# EasyEDA schematic 2513_Replacement.json
TITLE: APPLE-1 2513 CHAR ROM REPLACEMENT; REV: 1.2; Date: 2021-05-20; Sheet: 1/1; Drawn By: CP; Company: P-LAB
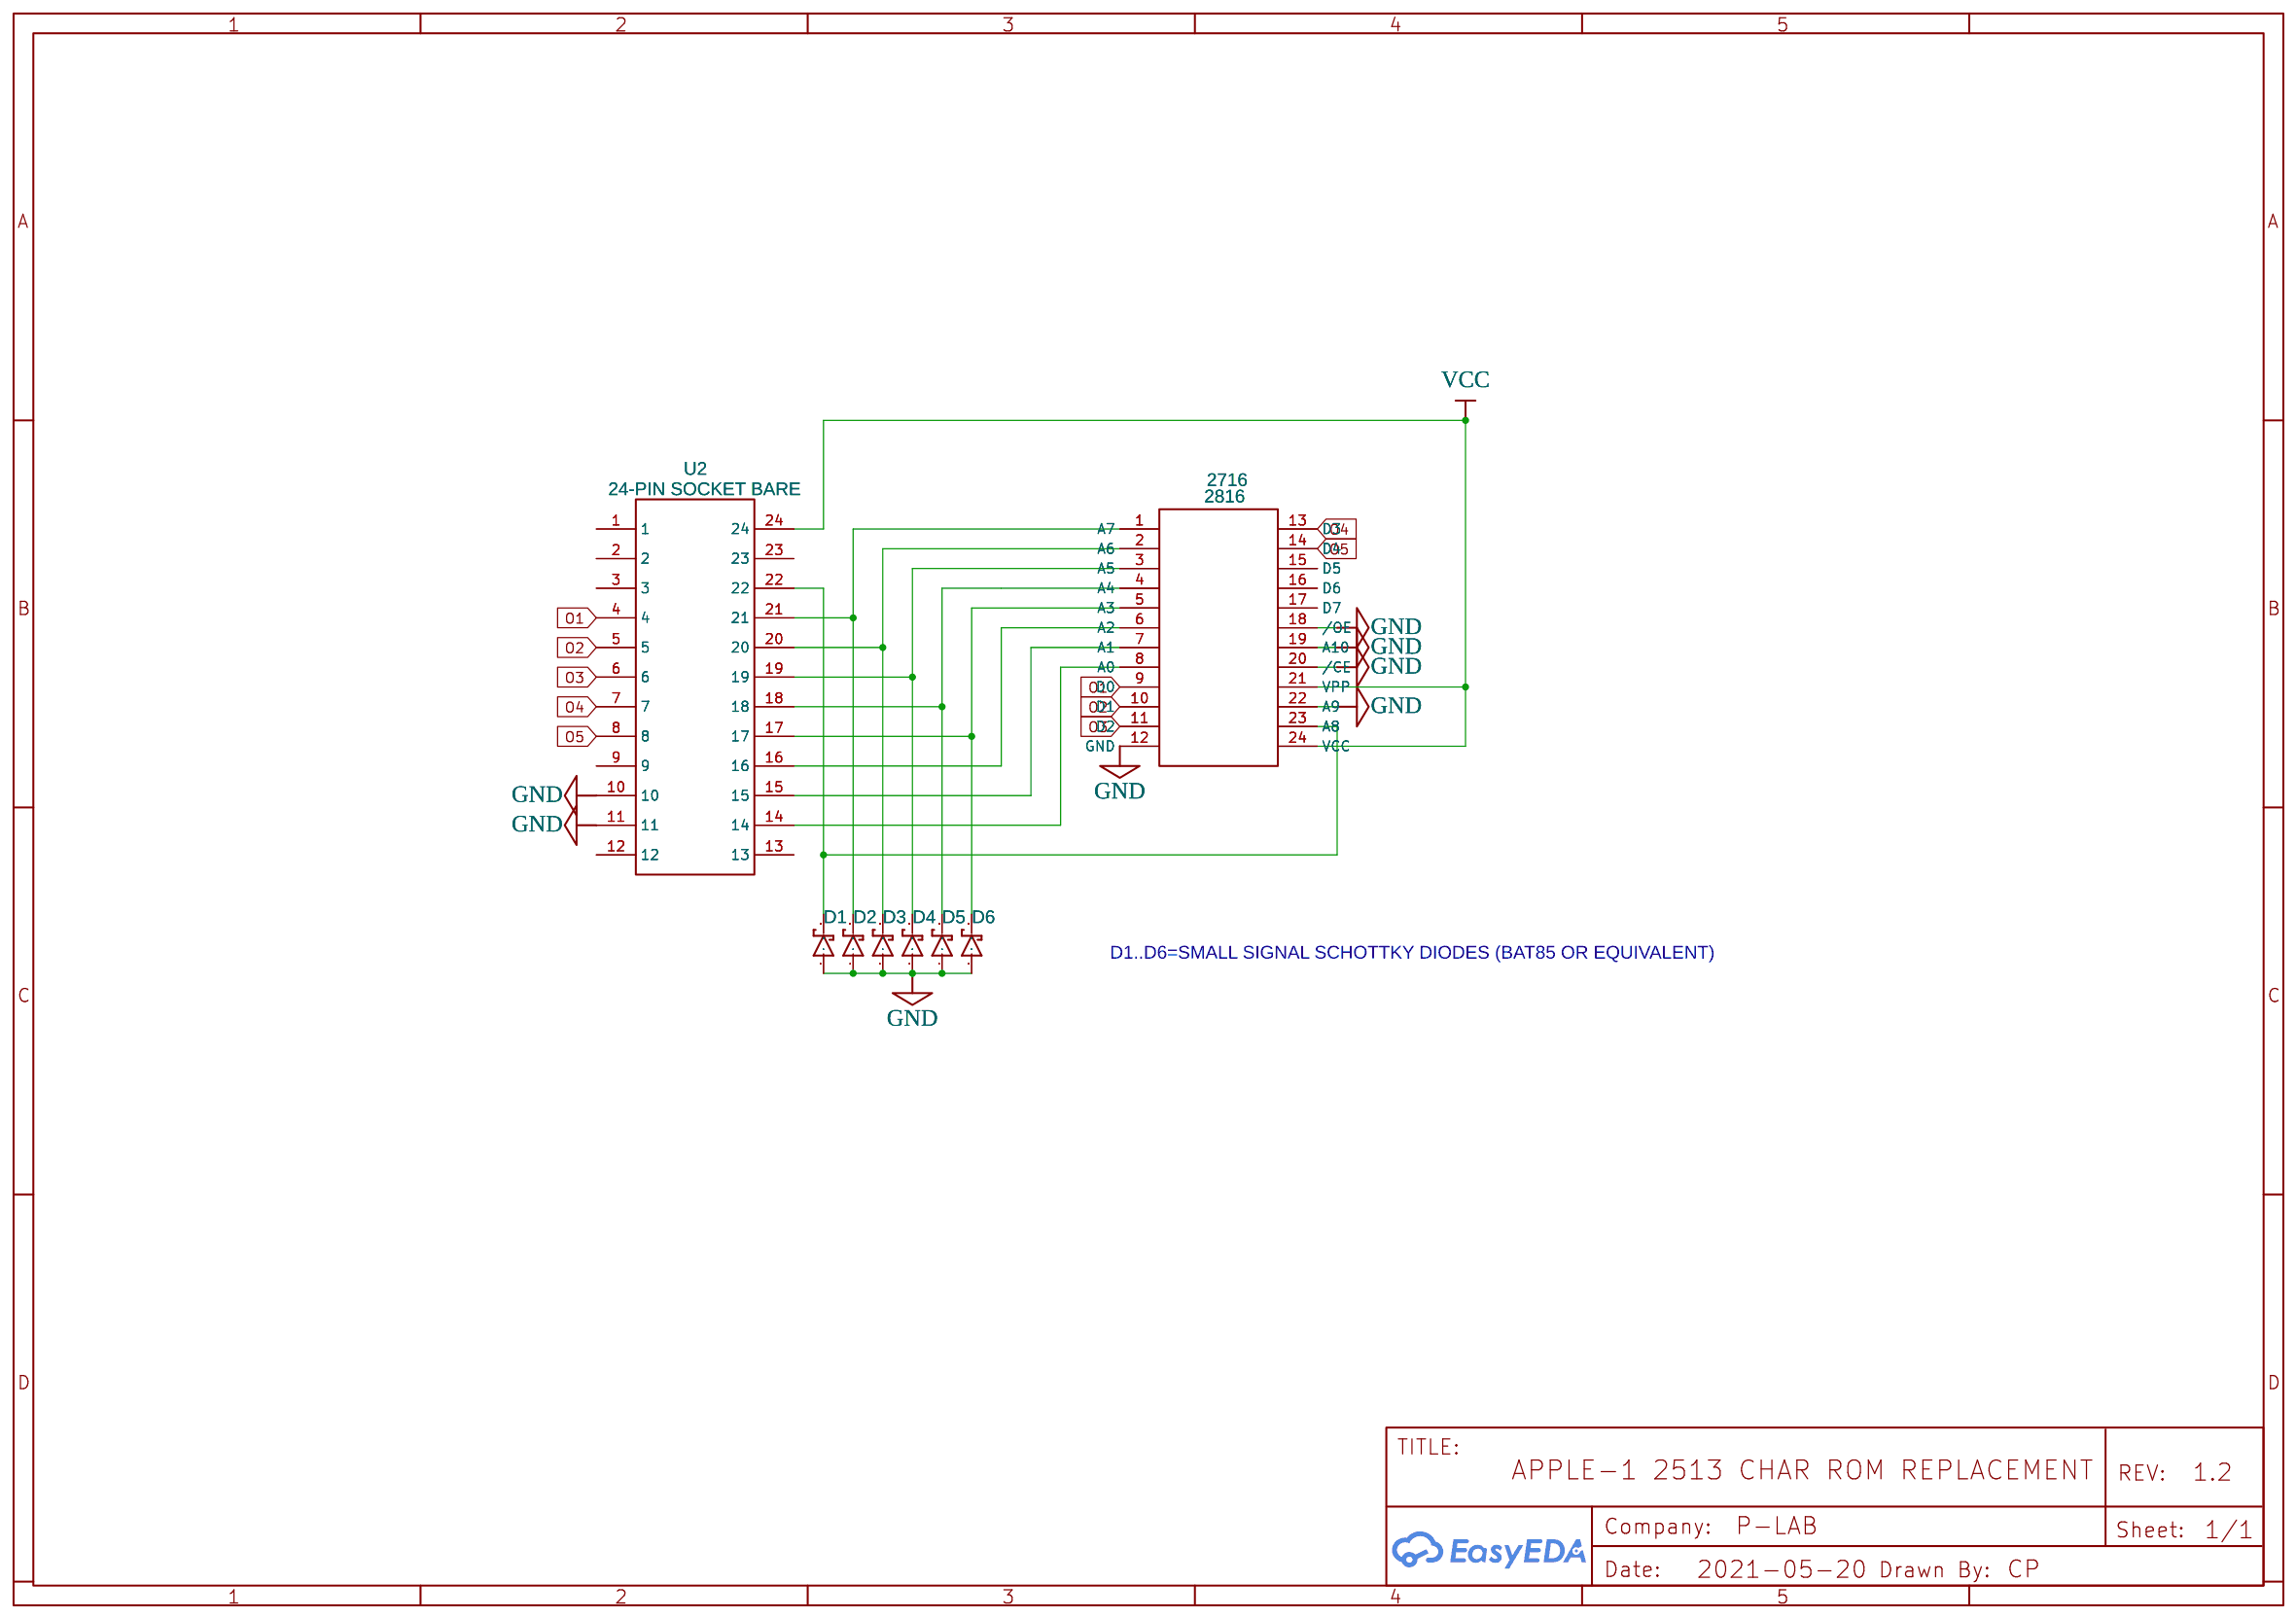
[diagram p0: schematic sheet]

## Parts
2716  2816  [DIP-24__600]
D1  SCHOTTKY  [DO35-3]
D2  SCHOTTKY  [DO35-3]
D3  SCHOTTKY  [DO35-3]
D4  SCHOTTKY  [DO35-3]
D5  SCHOTTKY  [DO35-3]
D6  SCHOTTKY  [DO35-3]
U2  24-PIN SOCKET BARE  [DIP-24_CP]

## Library data of the parts
2716 = 2716: Manufacturer Part: 27C16; Contributor: Team Ruh-Roh!
D1-D6 = SCHOTTKY: Contributor: Ph03Ni8; Package Display: No
U2 = 24-PIN SOCKET BARE: 28-PIN WIDE SOCKET; Contributor: Kyle P

## Nets
GND: 2716.12(GND) 2716.18(/OE) 2716.19(A10) 2716.20(/CE) 2716.22(A9) D1.A D2.A D3.A D4.A D5.A D6.A U2.10 U2.11
VCC: 2716.21(VPP) 2716.24(VCC) U2.24
O1: 2716.9(D0) U2.4
O2: 2716.10(D1) U2.5
O3: 2716.11(D2) U2.6
O4: 2716.13(D3) U2.7
O5: 2716.14(D4) U2.8
Net-(2716-1): 2716.1(A7) D2.C U2.21
Net-(2716-2): 2716.2(A6) D3.C U2.20
Net-(2716-3): 2716.3(A5) D4.C U2.19
Net-(2716-4): 2716.4(A4) D5.C U2.18
Net-(2716-5): 2716.5(A3) D6.C U2.17
Net-(2716-6): 2716.6(A2) U2.16
Net-(2716-7): 2716.7(A1) U2.15
Net-(2716-8): 2716.8(A0) U2.14
Net-(2716-23): 2716.23(A8) D1.C U2.22

Not connected (* = marked no-connect by the designer): 2716 15(D5) 16(D6) 17(D7); U2 1 2 3 9 12 13 23

## Notes on the sheet
- D1..D6=SMALL SIGNAL SCHOTTKY DIODES (BAT85 OR EQUIVALENT)
